# EAGLE design LN2 Autofill Controller (EAGLE 9.6.2)
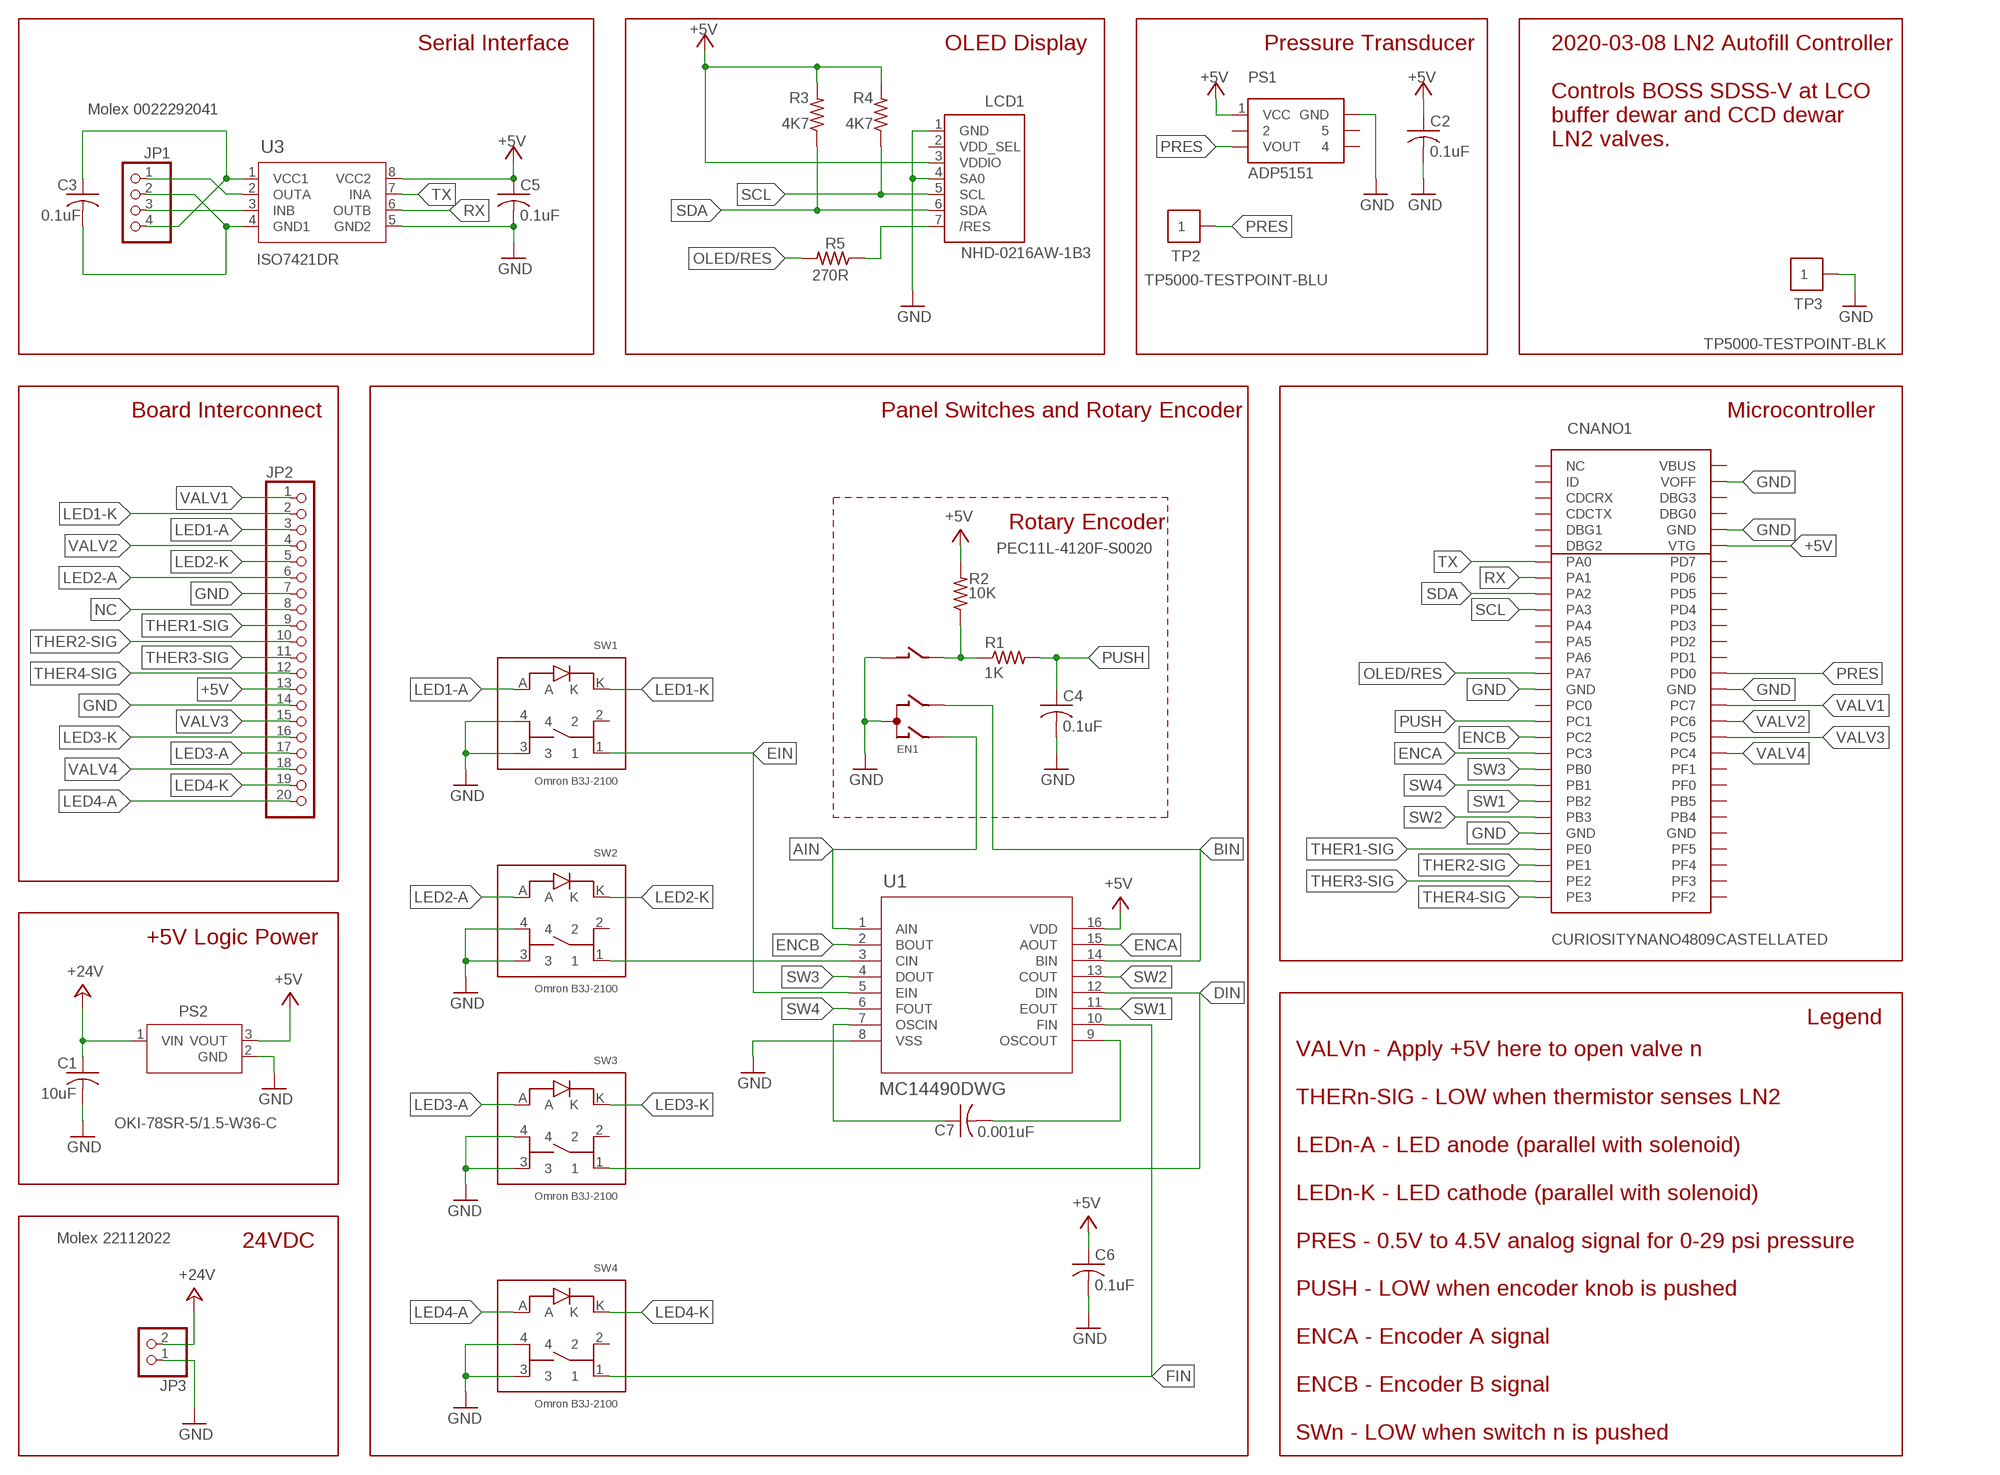
[diagram p0: schematic, sheet 1]

## Parts
C1  10uF  C-USC1210K  [C1210K]
C2  0.1uF  C-USC0805  [C0805]
C3  0.1uF  C-USC0805  [C0805]
C4  0.1uF  C-USC0805  [C0805]
C5  0.1uF  C-USC0805  [C0805]
C6  0.1uF  C-USC0805  [C0805]
C7  0.001uF  C-USC0805  [C0805]
CNANO1  CURIOSITYNANO4809CASTELLATED  [CURIOSITYNANO4809CASTELLATED]
EN1  PEC11L-4120F-S0020  ENC-BOURNES-PEC11L  [ENC-BOURNES-PEC11L]
JP1  Molex 0022292041  PINHD-1X4MOLEX-04-VERT  [MOLEX-04-VERT]
JP2  PINHD-1X20  [1X20]
JP3  Molex 22112022  PINHD-1X2MOLEX-02-VERT  [MOLEX-02-VERT]
LCD1  NHD-0216AW-1B3  LCD-NEWHAVEN-16X2  [LCD-NEWHAVEN-16X2]
PS1  ADP5151  PRESSURE-SENSOR-ADP5151  [PRESSURE-SENSOR-ADP5151]
PS2  OKI-78SR-5/1.5-W36-C  [CONV_OKI-78SR-5/1.5-W36-C]
R1  1K  R-US_R0805  [R0805]
R2  10K  R-US_R0805  [R0805]
R3  4K7  R-US_R0805  [R0805]
R4  4K7  R-US_R0805  [R0805]
R5  270R  R-US_R0805  [R0805]
SW1  Omron B3J-2100  SWITCH-OMRON-B3J-1LED  [SWITCH-OMRON-B3J-1LED]
SW2  Omron B3J-2100  SWITCH-OMRON-B3J-1LED  [SWITCH-OMRON-B3J-1LED]
SW3  Omron B3J-2100  SWITCH-OMRON-B3J-1LED  [SWITCH-OMRON-B3J-1LED]
SW4  Omron B3J-2100  SWITCH-OMRON-B3J-1LED  [SWITCH-OMRON-B3J-1LED]
TP2  TP5000-TESTPOINT-BLU  [TP5000-TESTPOINT-BLU]
TP3  TP5000-TESTPOINT-BLK  [TP5000-TESTPOINT-BLK]
U1  MC14490DWG  DEBOUNCER-MC14490DWGSOIC-16-WB  [SOIC127P1030X265-16N]
U3  ISO7421DR  ISO7421DRTI-SOIC-D8  [SOIC127P599X175-8N]

## Nets
+5V: C2.1 C5.1 C6.1 CNANO1.VTG JP2.13 LCD1.3(VDDIO) PS1.1(VCC) PS2.3(VOUT) R2.2 R3.2 R4.2 U1.16(VDD) U3.8(VCC2)
+24V: C1.1 JP3.2 PS2.1(VIN)
/RES: LCD1.7(/RES) R5.1
AIN: EN1.A U1.1(AIN)
BIN: EN1.B U1.14(BIN)
CIN: SW2.1 U1.3(CIN)
DIN: SW3.1 U1.12(DIN)
EIN: SW1.1 U1.5(EIN)
ENCA: CNANO1.PC3 U1.15(AOUT)
ENCB: CNANO1.PC2 U1.2(BOUT)
ENCBUTTON: EN1.1(B1) R1.1 R2.1
FIN: SW4.1 U1.10(FIN)
GND: C1.2 C2.2 C4.2 C5.2 C6.2 CNANO1.GND15(GND) CNANO1.GND24(GND) CNANO1.GND42(GND) CNANO1.GND52(GND) CNANO1.VOFF EN1.2(C1) EN1.C JP2.7 JP2.14 JP3.1 LCD1.1(GND) LCD1.4(SA0) PS1.6(GND) PS2.2(GND) SW1.3 SW1.4 SW2.3 SW2.4 SW3.3 SW3.4 SW4.3 SW4.4 TP3.P$1 U1.8(VSS) U3.5(GND2)
GND1: C3.2 JP1.2 U3.4(GND1)
INB: JP1.3 U3.3(INB)
LED1-A: JP2.3 SW1.A
LED1-K: JP2.2 SW1.K
LED2-A: JP2.6 SW2.A
LED2-K: JP2.5 SW2.K
LED3-A: JP2.17 SW3.A
LED3-K: JP2.16 SW3.K
LED4-A: JP2.20 SW4.A
LED4-K: JP2.19 SW4.K
NC: JP2.8
OLED/RES: CNANO1.PA7-SS(PA7) R5.2
OSCIN: C7.1 U1.7(OSCIN)
OSCOUT: C7.2 U1.9(OSCOUT)
OUTA: JP1.1 U3.2(OUTA)
PRES: CNANO1.PD0-AIN0(PD0) PS1.3(VOUT) TP2.P$1
PUSH: C4.1 CNANO1.PC1-RX(PC1) R1.2
RX: CNANO1.PA1-RX(PA1) U3.6(OUTB)
SCL: CNANO1.PA3-SCL(PA3) LCD1.5(SCL) R4.1
SDA: CNANO1.PA2-SDA(PA2) LCD1.6(SDA) R3.1
SW1: CNANO1.PB2 U1.11(EOUT)
SW2: CNANO1.PB3 U1.13(COUT)
SW3: CNANO1.PB0-TX(PB0) U1.4(DOUT)
SW4: CNANO1.PB1-RX(PB1) U1.6(FOUT)
THER1-SIG: CNANO1.PE0 JP2.9
THER2-SIG: CNANO1.PE1 JP2.10
THER3-SIG: CNANO1.PE2 JP2.11
THER4-SIG: CNANO1.PE3 JP2.12
TX: CNANO1.PA0-TX(PA0) U3.7(INA)
VALV1: CNANO1.PC7 JP2.1
VALV2: CNANO1.PC6 JP2.4
VALV3: CNANO1.PC5 JP2.15
VALV4: CNANO1.PC4 JP2.18
VCC1: C3.1 JP1.4 U3.1(VCC1)
Unconnected: CNANO1.GND33(GND) CNANO1.ID CNANO1.NC CNANO1.PA4-MOSI(PA4) CNANO1.PA5-MISO(PA5) CNANO1.PA6-SCK(PA6) CNANO1.PB0-RX(CDCRX) CNANO1.PB1-TX(CDCTX) CNANO1.PB4 CNANO1.PB5 CNANO1.PC0-TX(PC0) CNANO1.PD1-AIN1(PD1) CNANO1.PD2-AIN2(PD2) CNANO1.PD3-AIN3(PD3) CNANO1.PD4-AIN4(PD4) CNANO1.PD5-AIN5(PD5) CNANO1.PD6-AIN6(PD6) CNANO1.PD7-AIN7(PD7) CNANO1.PF0-TOSC1(PF0) CNANO1.PF1-TOSC2(PF1) CNANO1.PF2 CNANO1.PF2-6(DBG2) CNANO1.PF3 CNANO1.PF3-5(DBG1) CNANO1.PF4 CNANO1.PF5-LED(PF5) CNANO1.PF6-SW0(DBG3) CNANO1.UPDI(DBG0) CNANO1.VBUS LCD1.2(VDD_SEL) PS1.2 PS1.4 PS1.5 SW1.2 SW2.2 SW3.2 SW4.2

## Notes on the sheet
- Serial Interface | OLED Display | Pressure Transducer
- 2020-03-08 LN2 Autofill Controller
  
  Controls BOSS SDSS-V at LCO
  buffer dewar and CCD dewar
  LN2 valves.
- Board Interconnect | Panel Switches and Rotary Encoder | Microcontroller
- Rotary Encoder
- +5V Logic Power
- Legend
- 24VDC
- VALVn - Apply +5V here to open valve n
  
  THERn-SIG - LOW when thermistor senses LN2
  
  LEDn-A - LED anode (parallel with solenoid)
  
  LEDn-K - LED cathode (parallel with solenoid)
  
  PRES - 0.5V to 4.5V analog signal for 0-29 psi pressure
  
  PUSH - LOW when encoder knob is pushed 
  
  ENCA - Encoder A signal
  
  ENCB - Encoder B signal
  
  SWn - LOW when switch n is pushed

## Library data of the parts
C1-C7 = AUmlib:C-US: CAPACITOR, American symbol; SPICEPREFIX: C
CNANO1 = AUmlib:CURIOSITYNANO4809
EN1 = AUmlib:ENC-BOURNES-PEC11L
JP1 = AUmlib:PINHD-1X4: PIN HEADER
JP2 = AUmlib:PINHD-1X20: PIN HEADER
JP3 = AUmlib:PINHD-1X2: PIN HEADER
LCD1 = AUmlib:LCD-NEWHAVEN-16X2: Newhaven I2C LCD 16x2
PS1 = AUmlib:PRESSURE-SENSOR-ADP5151
PS2 = AUmlib:OKI-78SR-5/1.5-W36-C: OKI Series 8 W Single Output 5 V Non Isolated Through Hole DC/DC Converter; DESCRIPTION: Linear Regulator Replacement DC DC Converter 1 Output 5V 1.5A 7V - 36V Input; DIGI-KEY_PART_NUMBER: 811-2196-5-ND; MF: Murata Power Solutions Inc.; MP: OKI-78SR-5/1.5-W36-C; PACKAGE: SIP-3 Murata Power; PURCHASE-URL: https://pricing.snapeda.com/search/part/OKI-78SR-5/1.5-W36-C/?ref=eda
R1-R5 = AUmlib:R-US_: RESISTOR, American symbol; SPICEPREFIX: R
SW1-SW4 = AUmlib:SWITCH-OMRON-B3J-1LED: Omron B3J-2400 SPST MOM 1-LED
TP2 = AUmlib:TP5000-TESTPOINT-BLU
TP3 = AUmlib:TP5000-TESTPOINT-BLK
U1 = AUmlib:DEBOUNCER-MC14490DWG
U3 = AUmlib:ISO7421DR: ISO7421 Dual channel digital isolator.

## Board
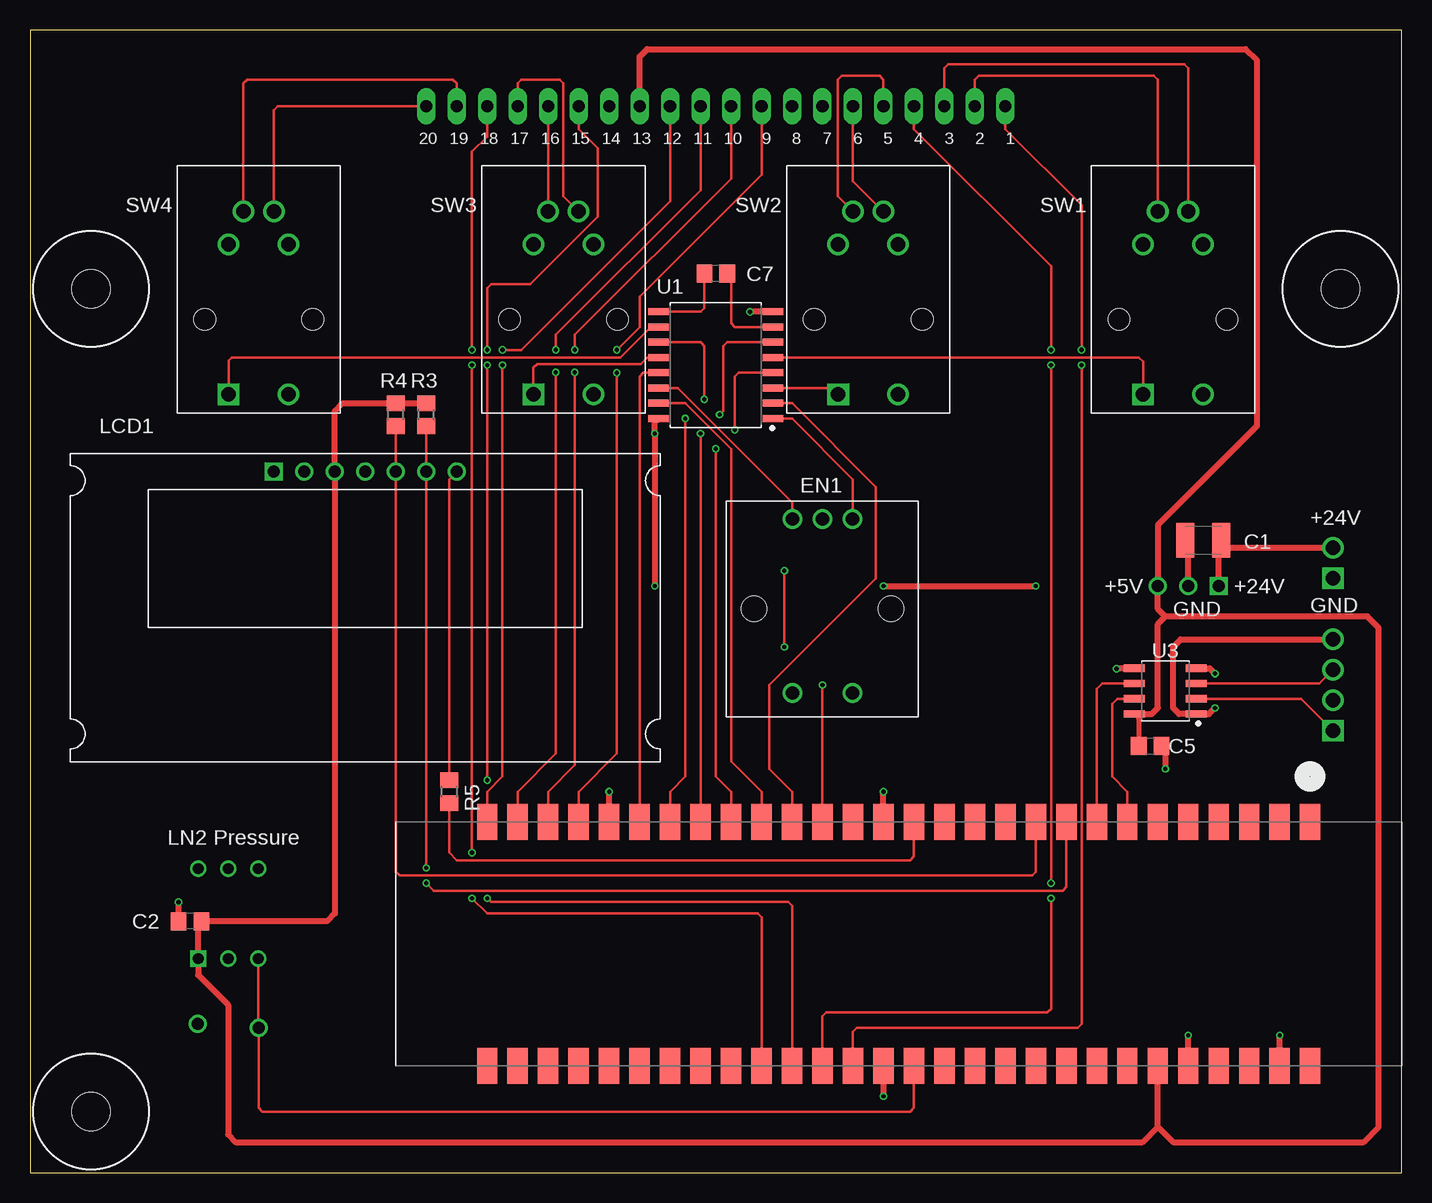
[diagram p1: board, top side]
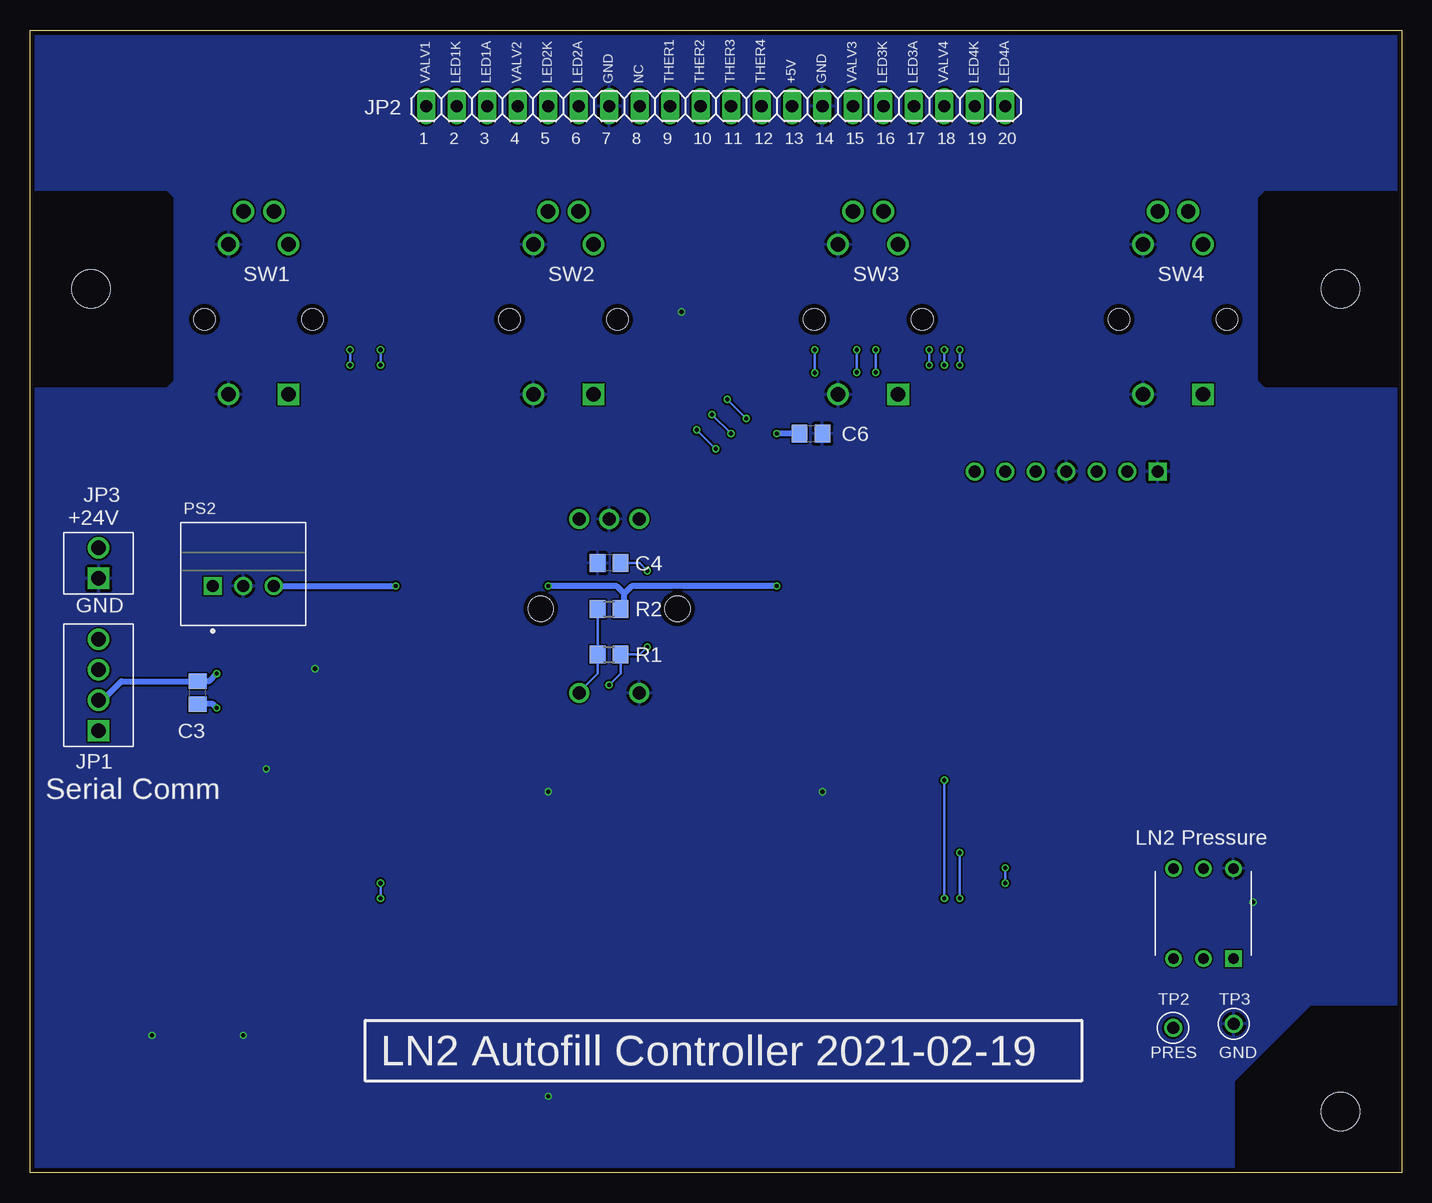
[diagram p2: board, bottom side, seen from below]

Size 114.3 x 95.25 mm. Coordinates in mm from the lower left corner, seen from the top.
Outline: 0,0 114.3,0 114.3,95.25 0,95.25 0,0
Copper layers (1*16): Top 0.035559375mm / dielectric 1.6mm / Bottom 0.035559375mm
Design rules "oshpark-2layer": minimum track width 6mil, minimum drill 10mil, track to track 6mil, track to pad 6mil, pad to pad 6mil, via to via 6mil, smd to smd 6mil, copper to edge 15mil, drill to drill 6mil, minimum pad ring 5mil, minimum via ring 5mil, stop-mask expansion 2.5mil, vias tented up to drill 0mil, thermal gap 10mil
Holes 3.17 mm at 5.08,73.66 109.22,73.66 5.08,5.08

### Footprints (pad centres in the part's own frame; a part is rotated, then mirrored left to right if it is on the bottom)
C1210K = smd 1.5 x 2.9: 1 -1.5,0; 2 1.5,0
C0805 = smd 1.3 x 1.5: 1 -0.95,0; 2 0.95,0
CURIOSITYNANO4809CASTELLATED = smd 3 x 1.7: GND15 -10.16,-1.27; GND24 -10.16,-24.13; GND33 10.16,-24.13; GND42 10.16,-1.27; GND52 10.16,24.13; ID -10.16,31.75; NC -10.16,34.29; PA0-TX -10.16,19.05; PA1-RX -10.16,16.51; PA2-SDA -10.16,13.97; PA3-SCL -10.16,11.43; PA4-MOSI -10.16,8.89; PA5-MISO -10.16,6.35; PA6-SCK -10.16,3.81; PA7-SS -10.16,1.27; PB0-RX -10.16,29.21; PB0-TX -10.16,-13.97; PB1-RX -10.16,-16.51; PB1-TX -10.16,26.67; PB2 -10.16,-19.05; PB3 -10.16,-21.59; PB4 10.16,-21.59; PB5 10.16,-19.05; PC0-TX -10.16,-3.81; PC1-RX -10.16,-6.35; PC2 -10.16,-8.89; PC3 -10.16,-11.43; PC4 10.16,-11.43; PC5 10.16,-8.89; PC6 10.16,-6.35; PC7 10.16,-3.81; PD0-AIN0 10.16,1.27; PD1-AIN1 10.16,3.81; PD2-AIN2 10.16,6.35; PD3-AIN3 10.16,8.89; PD4-AIN4 10.16,11.43; PD5-AIN5 10.16,13.97; PD6-AIN6 10.16,16.51; PD7-AIN7 10.16,19.05; PE0 -10.16,-26.67; PE1 -10.16,-29.21; PE2 -10.16,-31.75; PE3 -10.16,-34.29; PF0-TOSC1 10.16,-16.51; PF1-TOSC2 10.16,-13.97; PF2 10.16,-34.29; PF2-6 -10.16,21.59; PF3 10.16,-31.75; PF3-5 -10.16,24.13; PF4 10.16,-29.21; PF5-LED 10.16,-26.67; PF6-SW0 10.16,29.21; UPDI 10.16,26.67; VBUS 10.16,34.29; VOFF 10.16,31.75; VTG 10.16,21.59
ENC-BOURNES-PEC11L = drill 1.1: 1 -2.5,7; 2 2.5,7; A -2.5,-7.5; B 2.5,-7.5; C 0,-7.5 | hole 2.1: -5.7,0; 5.7,0
MOLEX-04-VERT = drill 1.194 square: 1 -3.81,0 | drill 1.194: 2 -1.27,0; 3 1.27,0; 4 3.81,0
1X20 = drill 1.016 long: 1 -24.13,0; 2 -21.59,0; 3 -19.05,0; 4 -16.51,0; 5 -13.97,0; 6 -11.43,0; 7 -8.89,0; 8 -6.35,0; 9 -3.81,0; 10 -1.27,0; 11 1.27,0; 12 3.81,0; 13 6.35,0; 14 8.89,0; 15 11.43,0; 16 13.97,0; 17 16.51,0; 18 19.05,0; 19 21.59,0; 20 24.13,0
MOLEX-02-VERT = drill 1.194 square: 1 0,0 | drill 1.194: 2 2.54,0
LCD-NEWHAVEN-16X2 = drill 1 square: 1 -7.62,0 | drill 1: 2 -5.08,0; 3 -2.54,0; 4 0,0; 5 2.54,0; 6 5.08,0; 7 7.62,0
PRESSURE-SENSOR-ADP5151 = drill 0.9 square: 1 -2.5,3.75 | drill 0.9: 2 0,3.75; 3 2.5,3.75; 4 2.5,-3.75; 5 0,-3.75; 6 -2.5,-3.75
CONV_OKI-78SR-5/1.5-W36-C = drill 1 pad 1.5 square: 1 -2.54,0 | drill 1 pad 1.5: 2 0,0; 3 2.54,0
R0805 = smd 1.3 x 1.5: 1 -0.95,0; 2 0.95,0
SWITCH-OMRON-B3J-1LED = drill 1.2 square: 1 -2.5,-6.25 | drill 1.2: 2 -2.5,6.25; 3 2.5,-6.25; 4 2.5,6.25; A 1.27,9; K -1.27,9 | hole 1.8: -4.5,0; 4.5,0
TP5000-TESTPOINT-BLU = drill 1: P$1 0,0
TP5000-TESTPOINT-BLK = drill 1: P$1 0,0
SOIC127P1030X265-16N = smd 1.724 x 0.589: 1 -4.769,4.445; 2 -4.769,3.175; 3 -4.769,1.905; 4 -4.769,0.635; 5 -4.769,-0.635; 6 -4.769,-1.905; 7 -4.769,-3.175; 8 -4.769,-4.445; 9 4.769,-4.445; 10 4.769,-3.175; 11 4.769,-1.905; 12 4.769,-0.635; 13 4.769,0.635; 14 4.769,1.905; 15 4.769,3.175; 16 4.769,4.445
SOIC127P599X175-8N = smd 1.751 x 0.599: 1 -2.578,1.905; 2 -2.578,0.635; 3 -2.578,-0.635; 4 -2.578,-1.905; 5 2.578,-1.905; 6 2.578,-0.635; 7 2.578,0.635; 8 2.578,1.905

### Placement (x,y rotation side)
C1  97.79,52.7 180 top
C2  13.34,20.95 180 top
C3  100.33,40.01 90 bottom
C4  66.04,50.8 180 bottom
C5  93.34,35.56 0 top
C6  49.21,61.59 0 bottom
C7  57.15,74.93 180 top
CNANO1  72.39,19.05 270 top
EN1  66.04,46.99 180 top
JP1  108.58,40.64 90 bottom
JP2  57.15,88.9 0 bottom
JP3  108.58,49.53 90 bottom
LCD1  27.94,58.42 0 top
PS1  16.51,21.59 180 bottom
PS2  96.52,48.9 0 bottom
R1  66.04,43.18 0 bottom
R2  66.04,46.99 0 bottom
R3  33.02,63.18 90 top
R4  30.48,63.18 90 top
R5  34.92,31.75 270 top
SW1  95.25,71.12 0 top
SW2  69.85,71.12 0 top
SW3  44.45,71.12 0 top
SW4  19.05,71.12 0 top
TP2  19.05,12.06 0 bottom
TP3  13.97,12.38 0 bottom
U1  57.15,67.31 180 top
U3  94.61,40.13 180 top

### Tracks (layer width: path | path; a pad name or v marks a point on that pad's centre or on a via)
+5V  (via drill 0.35)
  Top 0.254: U3.8 92.39,37.87
  Top 0.406: 92.39,37.87 C5.1
  Top 0.508: R3.2 R4.2 26.04,64.14 25.4,63.5 LCD1.3 25.4,21.59 24.77,20.95 C2.1 14.01,20.68 PS1.1 14.01,16.47 16.51,13.97 16.51,3.17 17.14,2.54 92.71,2.54 93.98,3.81 | 93.98,3.81 CNANO1.VTG | 93.98,3.81 95.25,2.54 111.12,2.54 112.39,3.81 112.39,45.4 111.44,46.35 94.61,46.35 | 94.61,46.35 93.98,46.99 PS2.3 93.98,53.98 102.23,62.23 102.23,92.71 101.28,93.66 51.44,93.66 50.8,93.03 JP2.13 | U3.8 93.47,38.23 93.98,38.73 93.98,45.72 94.61,46.35 | U1.16 52.07,62.55 v52.07,61.59 v52.07,48.9 | v71.12,48.9 v83.82,48.9
  Bottom 0.508: C6.1 v52.07,61.59 | v52.07,48.9 64.14,48.9 64.77,48.26 | 64.77,48.26 65.41,48.9 v71.12,48.9 | PS2.3 v83.82,48.9 | R2.2 64.77,47.31 64.77,48.26
+24V
  Top 0.508: JP3.2 99.69,52.07 99.29,52.48 | 99.29,52.48 C1.1 | PS2.1 99.06,52.24 99.29,52.48
/RES
  Top 0.203: R5.1 34.92,57.78 LCD1.7
AIN
  Top 0.152: 68.58,54.53 EN1.A
  Top 0.203: U1.1 63.5,62.87 68.58,57.78 68.58,54.53
BIN
  Top 0.203: U1.14 53.98,65.41 63.54,55.84 EN1.B
CIN
  Top 0.203: SW2.1 66.81,65.41 U1.3
DIN
  Top 0.203: U1.12 51.44,67.94 50.9,67.41 42.27,67.41 41.95,67.09 SW3.1
EIN
  Top 0.203: U1.5 92.39,67.94 92.75,67.59 SW1.1
ENCA
  Top 0.203: CNANO1.PC3 60.96,31.75 58.42,34.29 58.42,60.33 54.61,64.14 U1.15
ENCB
  Top 0.203: U1.2 63.5,64.14 70.48,57.15 70.48,49.53 61.59,40.64 61.59,33.66 63.5,31.75 CNANO1.PC2
ENCBUTTON
  Bottom 0.203: R2.1 R1.1 66.99,41.59 68.59,39.99
  Bottom 0.254: EN1.1 68.59,39.99
FIN
  Top 0.203: 51.75,70.48 49.21,67.94 16.83,67.94 16.55,67.67 SW4.1
  Top 0.254: U1.10 51.75,70.48
GND  (via drill 0.35)
  Top 0.508: C2.2 v12.38,22.54 | C5.2 94.61,35.24 v94.61,33.66 | CNANO1.GND24 v48.26,31.75 | CNANO1.GND15 v71.12,31.75 | U1.8 v60.01,71.75 | CNANO1.GND42 v71.12,6.35 | CNANO1.GND52 v96.52,11.43 | C1.2 96.52,52.48 PS2.2 | CNANO1.VOFF v104.14,11.43 | U3.5 92.04,42.01 v90.55,42.01
  pour Bottom: 114.3,0 114.3,65.41 102.87,65.41 102.23,66.04 102.23,81.28 102.87,81.92 114.3,81.92 114.3,95.25 0,95.25 0,81.92 11.43,81.92 12.06,81.28 12.06,66.04 11.43,65.41 0,65.41 0,13.97 7.62,13.97 13.97,7.62 13.97,0
GND1  (via drill 0.35)
  Top 0.508: U3.4 98.3,42.04 v98.74,41.59
  Bottom 0.508: v98.74,41.59 99.38,40.95 C3.2 106.68,40.96 108.27,39.37 JP1.2
INB
  Top 0.203: U3.3 107.44,40.77 JP1.3
LED1-A
  Top 0.203: JP2.3 76.2,92.08 76.52,92.39 96.2,92.39 96.52,92.08 SW1.A
LED1-K
  Top 0.203: JP2.2 78.74,91.12 79.06,91.44 93.66,91.44 93.98,91.12 SW1.K
LED2-A
  Top 0.203: SW2.A 68.58,82.66 JP2.6
LED2-K
  Top 0.203: SW2.K 67.31,81.39 67.31,91.12 67.63,91.44 70.8,91.44 71.12,91.12 JP2.5
LED3-A
  Top 0.203: SW3.A 44.45,81.39 44.45,90.81 44.13,91.12 40.96,91.12 40.64,90.81 JP2.17
LED3-K
  Top 0.203: SW3.K JP2.16
LED4-A
  Top 0.203: SW4.A 20.32,88.58 20.64,88.9 JP2.20
LED4-K
  Top 0.203: SW4.K 17.78,90.81 18.1,91.12 35.24,91.12 35.56,90.81 JP2.19
OLED/RES
  Top 0.203: R5.2 34.92,26.67 35.56,26.04 73.34,26.04 73.66,26.35 CNANO1.PA7-SS
OSCIN
  Top 0.203: 58.42,74.61 58.42,70.8 58.74,70.48 U1.7
  Top 0.254: C7.1 58.42,74.61
OSCOUT
  Top 0.203: U1.9 55.88,71.75 56.2,72.08 C7.2
OUTA
  Top 0.203: U3.2 105.92,39.5 JP1.1
PRES
  Top 0.152: 19.01,12.11 TP2.P$1
  Top 0.203: PS1.3 19.01,12.11 | CNANO1.PD0-AIN0 73.66,5.4 73.34,5.08 19.37,5.08 19.05,5.4 TP2.P$1
PUSH  (via drill 0.35)
  Top 0.203: CNANO1.PC1-RX v66.04,40.64 | v62.87,50.16 v62.87,43.81
  Bottom 0.203: v66.04,40.64 65.09,41.59 R1.2 63.5,43.18 v62.87,43.81 | v62.87,50.16 63.5,50.8 C4.1
RX
  Top 0.203: CNANO1.PA1-RX 88.9,40.32 89.34,40.77 U3.6
SCL
  Top 0.203: CNANO1.PA3-SCL 83.82,25.08 83.5,24.77 30.8,24.77 30.48,25.08 LCD1.5 R4.1
SDA  (via drill 0.35)
  Top 0.203: CNANO1.PA2-SDA 86.36,23.81 86.04,23.5 33.66,23.5 v33.02,24.13 | R3.1 LCD1.6 v33.02,25.4
  Bottom 0.203: v33.02,25.4 v33.02,24.13
SW1  (via drill 0.35)
  Top 0.203: CNANO1.PB2 53.34,31.75 54.61,33.02 v54.61,62.87 | v56.2,64.45 56.2,68.9 55.88,69.22 U1.11
  Bottom 0.203: v56.2,64.45 v54.61,62.87
SW2
  Top 0.203: CNANO1.PB3 50.8,66.36 51.12,66.67 U1.13
SW3  (via drill 0.35)
  Top 0.203: CNANO1.PB0-TX 58.42,31.75 57.15,33.02 v57.15,60.33 | v58.74,61.91 58.74,66.36 59.05,66.67 U1.4
  Bottom 0.203: v58.74,61.91 v57.15,60.33
SW4  (via drill 0.35)
  Top 0.203: CNANO1.PB1-RX v55.88,61.59 | v57.47,63.18 57.78,63.5 57.78,68.9 58.1,69.22 U1.6
  Bottom 0.203: v57.47,63.18 v55.88,61.59
THER1-SIG  (via drill 0.35)
  Top 0.203: JP2.9 60.96,83.19 50.8,73.03 50.8,70.48 v48.9,68.58 | v48.9,66.67 48.9,34.92 45.72,31.75 CNANO1.PE0
  Bottom 0.203: v48.9,68.58 v48.9,66.67
THER2-SIG  (via drill 0.35)
  Top 0.203: v45.4,68.58 45.4,69.85 58.42,82.87 JP2.10 | CNANO1.PE1 43.18,31.75 45.4,33.97 v45.4,66.71
  Bottom 0.203: v45.4,68.58 v45.4,66.71
THER3-SIG  (via drill 0.35)
  Top 0.203: v43.81,68.58 43.81,69.85 55.88,81.92 JP2.11 | v43.81,66.71 43.81,34.92 40.64,31.75 CNANO1.PE2
  Bottom 0.203: v43.81,68.58 v43.81,66.71
THER4-SIG  (via drill 0.35)
  Top 0.203: JP2.12 53.34,80.96 40.96,68.58 v39.37,68.58 | CNANO1.PE3 38.1,31.75 39.37,33.02 v39.37,67.31
  Bottom 0.203: v39.37,68.58 v39.37,67.31
TX
  Top 0.203: CNANO1.PA0-TX 91.44,31.75 90.17,33.02 90.17,39.05 90.61,39.5 U3.7
VALV1  (via drill 0.35)
  Top 0.203: CNANO1.PC7 68.58,11.75 68.9,12.06 87.31,12.06 87.63,12.38 v87.63,67.31 | v87.63,68.58 87.63,80.64 81.28,87 JP2.1
  Bottom 0.203: v87.63,67.31 v87.63,68.58
VALV2  (via drill 0.35)
  Top 0.203: CNANO1.PC6 66.04,13.02 66.36,13.34 84.77,13.34 85.09,13.65 v85.09,22.86 | v85.09,24.13 v85.09,67.31 | v85.09,68.58 85.09,75.56 73.66,87 JP2.4
  Bottom 0.203: v85.09,22.86 v85.09,24.13 | v85.09,67.31 v85.09,68.58
VALV3  (via drill 0.35)
  Top 0.203: JP2.15 45.72,87 47.31,85.41 47.31,79.69 41.68,74.06 38.44,74.06 38.1,73.73 v38.1,68.58 | v38.1,67.31 v38.1,32.7 | v38.1,22.86 38.42,22.54 63.18,22.54 63.5,22.23 CNANO1.PC5
  Bottom 0.203: v38.1,68.58 v38.1,67.31 | v38.1,32.7 v38.1,22.86
VALV4  (via drill 0.35)
  Top 0.203: CNANO1.PC4 60.96,21.27 60.64,21.59 38.1,21.59 v36.83,22.86 | v36.83,26.67 v36.83,67.31 | JP2.18 38.1,86.36 36.83,85.09 v36.83,68.58
  Bottom 0.203: v36.83,22.86 v36.83,26.67 | v36.83,67.31 v36.83,68.58
VCC1  (via drill 0.35)
  Top 0.508: v98.74,38.73 98.23,38.23 U3.1 95.76,38.23 95.25,38.73 95.25,43.81 95.89,44.45 JP1.4
  Bottom 0.508: v98.74,38.73 99.06,39.05 C3.1

### Text on the board
tPlace: 20 | 19 | 18 | 17 | 16 | 15 | 14 | 13 | 12 | 11 | 10 | 9 | 8 | 7 | 6 | 5 | 4 | 3 | 2 | 1 | +24V | +5V | +24V | GND | GND | LN2 Pressure
bPlace: LED4A | LED4K | VALV4 | LED3A | LED3K | VALV3 | GND | +5V | THER4 | THER3 | THER2 | THER1 | NC | GND | LED2A | LED2K | VALV2 | LED1A | LED1K | VALV1 | 20 | 19 | 18 | 17 | 16 | 15 | 14 | 13 | 12 | 11 | 10 | 9 | 8 | 7 | 6 | 5 | 4 | 3 | 2 | 1 | SW4 | SW3 | SW2 | SW1 | +24V | GND | Serial Comm | LN2 Pressure | GND | PRES | LN2 Autofill Controller 2021-02-19